# EAGLE schematic drone3 (EAGLE 9.6.2)
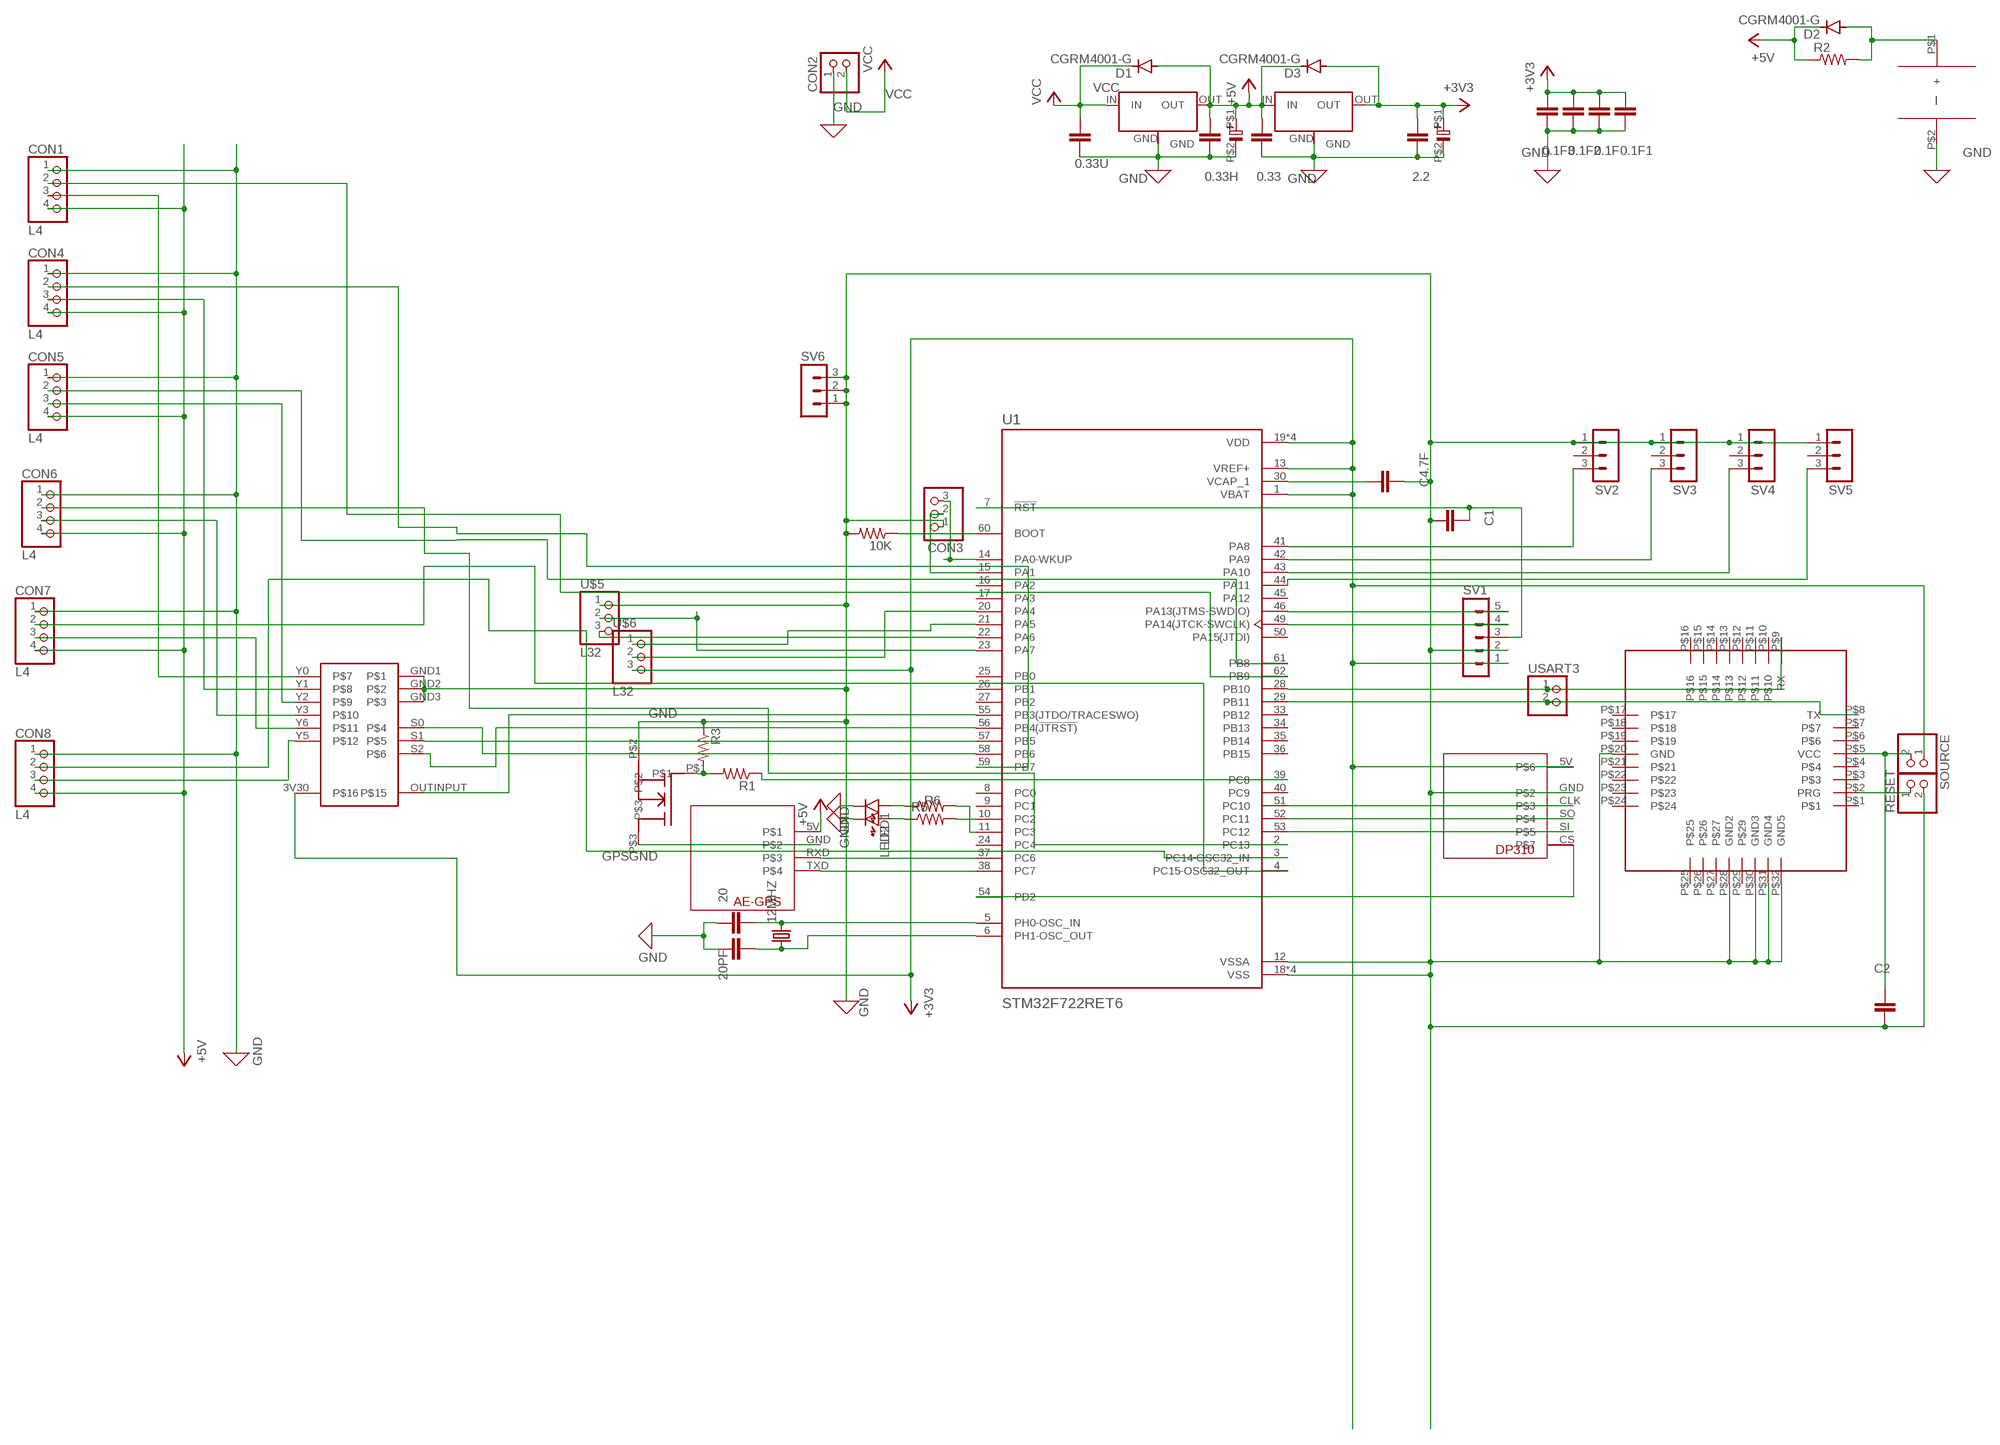
[diagram p0: schematic, sheet 1]

## Parts
0.1F  C-EUC0603  [C0603]
0.1F1  C-EUC0603  [C0603]
0.1F2  C-EUC0603  [C0603]
0.1F3  C-EUC0603  [C0603]
0.33  C-EUC0603  [C0603]
0.33H  C-EUC0603  [C0603]
0.33U  C-EUC0603  [C0603]
2.2  C-EUC0603  [C0603]
10K  R-US_R0603  [R0603]
12MHZ  CRYSTALHC49S  [HC49/S]
20  C-EUC0603  [C0603]
20PF  C-EUC0603  [C0603]
47  UCD0J470MCL1GS  [UCD0J470MCL1GS]
47U  UCD0J470MCL1GS  [UCD0J470MCL1GS]
C1  C-EUC0603  [C0603]
C2  C-EUC0603  [C0603]
C4.7F  C-EUC0603  [C0603]
CON1  L4  [L_4]
CON2  L2  [L_2]
CON3  L3  [L_3]
CON4  L4  [L_4]
CON5  L4  [L_4]
CON6  L4  [L_4]
CON7  L4  [L_4]
CON8  L4  [L_4]
CS1  DP310DP310  [AE-GPS-HOLE]
D1  CGRM4001-G  [SOD-123_MINI-SMA]
D2  CGRM4001-G  [SOD-123_MINI-SMA]
D3  CGRM4001-G  [SOD-123_MINI-SMA]
LED1  LED1608  [LED1608]
LED2  LED1608  [LED1608]
OUTPUT  MULTI  [MULTI]
R1  R-US_R0603  [R0603]
R2  R-US_0207/7  [0207/7]
R3  R-US_R0603  [R0603]
R5  R-US_R0603  [R0603]
R6  R-US_R0603  [R0603]
RESET  PINHD-1X2  [1X02]
SOURCE  PINHD-1X2  [1X02]
SV1  MA05-1  [MA05-1]
SV2  MA03-1  [MA03-1]
SV3  MA03-1  [MA03-1]
SV4  MA03-1  [MA03-1]
SV5  MA03-1  [MA03-1]
SV6  MA03-1  [MA03-1]
U1  STM32F722RET6  [QFP50P1200X1200X160-64N]
U$1  LITE  [LITE]
U$3  AE-GPS-HOLE  [AE-GPS-HOLE]
U$4  NJM2391DL1-33  [NJM2391DL1-33]
U$5  L32  [L_32]
U$6  L32  [L_32]
U$7  SSM3K329R  [SSM3K329R]
U$8  VEC5R4355QG-I  [VEC5R4355QG-I]
U$9  NJM2391DL1-33  [NJM2391DL1-33]
USART3  PINHD-1X2  [1X02]

## Nets
+3V3 [New Class]: 0.1F1.1 0.1F2.1 0.1F3.1 0.1F.1 2.2.1 47.P$1(+) CS1.5V D3.A OUTPUT.3V30 SOURCE.1 SV1.1 U1.1(VBAT) U1.13(VREF+) U1.19(VDD) U1.32(VDD) U1.48(VDD) U1.64(VDD) U$4.OUT U$6.3
+5V [New Class]: 0.33.1 0.33H.1 47U.P$1(+) CON1.4 CON4.4 CON5.4 CON6.4 CON7.4 CON8.4 D1.A D2.C D3.C R2.1 U$3.5V U$4.IN U$9.OUT
CLK3: CS1.CLK U1.51(PC10)
GND: 0.1F1.2 0.1F2.2 0.1F3.2 0.1F.2 0.33.2 0.33H.2 0.33U.2 2.2.2 10K.2 20.1 20PF.1 47.P$2(ー) 47U.P$2(ー) C1.1 C2.1 C4.7F.2 CON1.1 CON2.1 CON3.1 CON4.1 CON5.1 CON6.1 CON7.1 CON8.1 CS1.GND LED1.K LED2.K OUTPUT.GND1 OUTPUT.GND2 OUTPUT.GND3 R3.1 RESET.2 SV1.2 SV2.1 SV3.1 SV4.1 SV5.1 SV6.1 SV6.2 SV6.3 U1.12(VSSA) U1.18(VSS) U1.31(VSS) U1.47(VSS) U1.63(VSS) U$1.P$20(GND) U$1.P$28(GND2) U$1.P$30(GND3) U$1.P$31(GND4) U$1.P$32(GND5) U$4.GND U$5.1 U$7.P$2 U$8.P$2(ー) U$9.GND
GPSGND: U$3.GND U$7.P$3
MISO1: U1.22(PA6) U$5.3
MISO3: CS1.SO U1.52(PC11)
MOSI1: U1.23(PA7) U$5.2
MOSI3: CS1.SI U1.53(PC12)
MPUCS: U1.20(PA4) U$6.2
N$1: 10K.1 U1.60(BOOT)
N$2: OUTPUT.OUTINPUT U1.55(PB3(JTDO/TRACESWO))
N$3: LED2.A R5.1
N$4: C4.7F.1 U1.30(VCAP_1)
N$5: SV1.5 U1.46(PA13(JTMS-SWDIO))
N$6: SV1.4 U1.49(PA14(JTCK-SWCLK))
N$7: U1.29(PB11) U$1.P$8(TX) USART3.2
N$8: CS1.CS U1.54(PD2)
N$9: U1.28(PB10) U$1.P$9(RX) USART3.1
N$10: C2.2 SOURCE.2 U$1.P$5(VCC)
N$11: RESET.1 U$1.P$2(PRG)
N$13: SV2.3 U1.41(PA8)
N$14: SV3.3 U1.42(PA9)
N$15: SV4.3 U1.43(PA10)
N$16: SV5.3 U1.44(PA11)
N$17: R6.2 U1.11(PC3)
N$18: LED1.A R6.1
N$19: 12MHZ.1 20PF.2 U1.6(PH1-OSC_OUT)
N$20: CON5.2 U1.61(PB8)
N$21: CON1.2 U1.62(PB9)
N$22: CON3.3 U1.14(PA0-WKUP)
N$23: CON8.2 U1.3(PC14-OSC32_IN)
N$24: OUTPUT.S0 U1.58(PB6)
N$25: OUTPUT.S1 U1.57(PB5)
N$26: OUTPUT.S2 U1.56(PB4(!JTRST))
N$27: CON3.2 U1.15(PA1)
N$28: R5.2 U1.10(PC2)
N$29: R1.1 U1.39(PC8)
N$30: CON8.3 OUTPUT.Y5
N$31: D2.A R2.2 U$8.P$1(+)
N$32: CON7.3 OUTPUT.Y6
N$33: R1.2 R3.2 U$7.P$1
N$35: CON7.2 U1.4(PC15-OSC32_OUT)
N$36: CON6.3 OUTPUT.Y3
N$37: CON6.2 U1.2(PC13)
N$38: CON5.3 OUTPUT.Y2
N$40: CON4.3 OUTPUT.Y1
N$41: CON4.2 U1.59(PB7)
N$42: CON1.3 OUTPUT.Y0
NRST: C1.2 SV1.3 U1.7(!RST)
PH0_OSC_IN: 12MHZ.2 20.2 U1.5(PH0-OSC_IN)
SCK1: U1.21(PA5) U$6.1
UART6RX: U1.38(PC7) U$3.TXD
UART6TX: U1.37(PC6) U$3.RXD
VCC: 0.33U.1 CON2.2 D1.C U$9.IN
Unconnected: SV2.2 SV3.2 SV4.2 SV5.2 U1.8(PC0) U1.9(PC1) U1.16(PA2) U1.17(PA3) U1.24(PC4) U1.25(PB0) U1.26(PB1) U1.27(PB2) U1.33(PB12) U1.34(PB13) U1.35(PB14) U1.36(PB15) U1.40(PC9) U1.45(PA12) U1.50(PA15(JTDI)) U$1.P$1 U$1.P$3 U$1.P$4 U$1.P$6 U$1.P$7 U$1.P$10 U$1.P$11 U$1.P$12 U$1.P$13 U$1.P$14 U$1.P$15 U$1.P$16 U$1.P$17 U$1.P$18 U$1.P$19 U$1.P$21 U$1.P$22 U$1.P$23 U$1.P$24 U$1.P$25 U$1.P$26 U$1.P$27 U$1.P$29

## Library data of the parts
0.1F 0.1F1-0.1F3 0.33 0.33H 0.33U 2.2 20 20PF C1 C2 C4.7F = rcl:C-EU: CAPACITOR, European symbol; SPICEPREFIX: C
10K R1-R3 R5 R6 = rcl:R-US_: RESISTOR, American symbol; SPICEPREFIX: R
12MHZ = crystal:CRYSTAL: CRYSTAL; OC_FARNELL: 1667008; OC_NEWARK: unknown; SPICEPREFIX: B
47 47U = chip-capacitor:UCD0J470MCL1GS
CON1 CON4-CON8 = CREATE_sensor_dip:L4
CON2 = CREATE_sensor_dip:L2
CON3 = CREATE_sensor_dip:L3
CS1 = DP310:DP310
D1-D3 = diode:CGRM400*-G: Molded plasitc,JEDEC SOD-123/Mini SMA Source: Comchip CGRM4001-G.pdf
LED1 LED2 = generic:LED: Generic LEDs
OUTPUT = multiprexer:MULTI
RESET SOURCE USART3 = pinhead:PINHD-1X2: PIN HEADER
SV1 = con-lstb:MA05-1: PIN HEADER; OC_FARNELL: unknown; OC_NEWARK: unknown
SV2-SV6 = con-lstb:MA03-1: PIN HEADER; OC_FARNELL: unknown; OC_NEWARK: unknown
U1 = STM32F722RET6:STM32F722RET6: STM32F Series 512 KB Flash 256 kB RAM 216 MHz 32-Bit Microcontroller - LQFP-64 Check availability <https://pricing.snapeda.com/parts/STM32F722RET6/STMicroelectronics/view-part?ref=eda>; AVAILABILITY: In Stock; DESCRIPTION: ARM® Cortex®-M7 STM32F7 Microcontroller IC 32-Bit Single-Core 216MHz 512KB (512K x 8) FLASH 64-LQFP (10x10); MF: STMicroelectronics; MP: STM32F722RET6; PACKAGE: LQFP-64 STMicroelectronics; PRICE: None; PURCHASE-URL: https://pricing.snapeda.com/search/part/STM32F722RET6/?ref=eda
U$1 = TWELite:LITE
U$3 = AE-GPS-HOLE:AE-GPS-HOLE
U$4 U$9 = CREATE_sensor_dip:NJM2391DL1-33
U$5 U$6 = CREATE_sensor_dip:L32
U$7 = SSM3K329R:SSM3K329R
U$8 = VEC5R4355QG-I:VEC5R4355QG-I